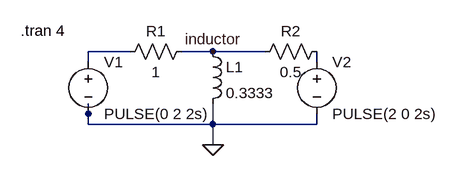
[diagram p0: schematic B24.asc]
B24.asc, the LTspice schematic file:
Version 4
SHEET 1 880 680
WIRE 112 96 48 96
WIRE 240 96 192 96
WIRE 320 96 240 96
WIRE 48 112 48 96
WIRE 400 112 400 96
WIRE 48 192 48 176
WIRE 48 208 48 192
WIRE 240 208 240 176
WIRE 240 208 48 208
WIRE 400 208 400 192
WIRE 400 208 240 208
WIRE 240 240 240 208
FLAG 240 240 0
FLAG 240 96 inductor
SYMBOL res 208 80 R90
WINDOW 0 0 56 VBottom 2
WINDOW 3 32 56 VTop 2
SYMATTR InstName R1
SYMATTR Value 1
SYMBOL res 416 80 R90
WINDOW 0 0 56 VBottom 2
WINDOW 3 32 56 VTop 2
SYMATTR InstName R2
SYMATTR Value 0.5
SYMBOL ind 224 80 R0
SYMATTR InstName L1
SYMATTR Value 0.3333
SYMBOL voltage 48 96 R0
WINDOW 123 0 0 Left 0
WINDOW 39 0 0 Left 0
SYMATTR InstName V1
SYMATTR Value PULSE(0 2 2s)
SYMBOL voltage 400 96 R0
WINDOW 123 0 0 Left 0
WINDOW 39 0 0 Left 0
SYMATTR InstName V2
SYMATTR Value PULSE(2 0 2s)
TEXT -56 64 Left 2 !.tran 4

The netlist it stands for:
* B24.asc
R1 inductor N001 1
R2 N002 inductor 0.5
L1 inductor 0 0.3333
V1 N001 0 PULSE(0 2 2s)
V2 N002 0 PULSE(2 0 2s)
.tran 4
.backanno
.end